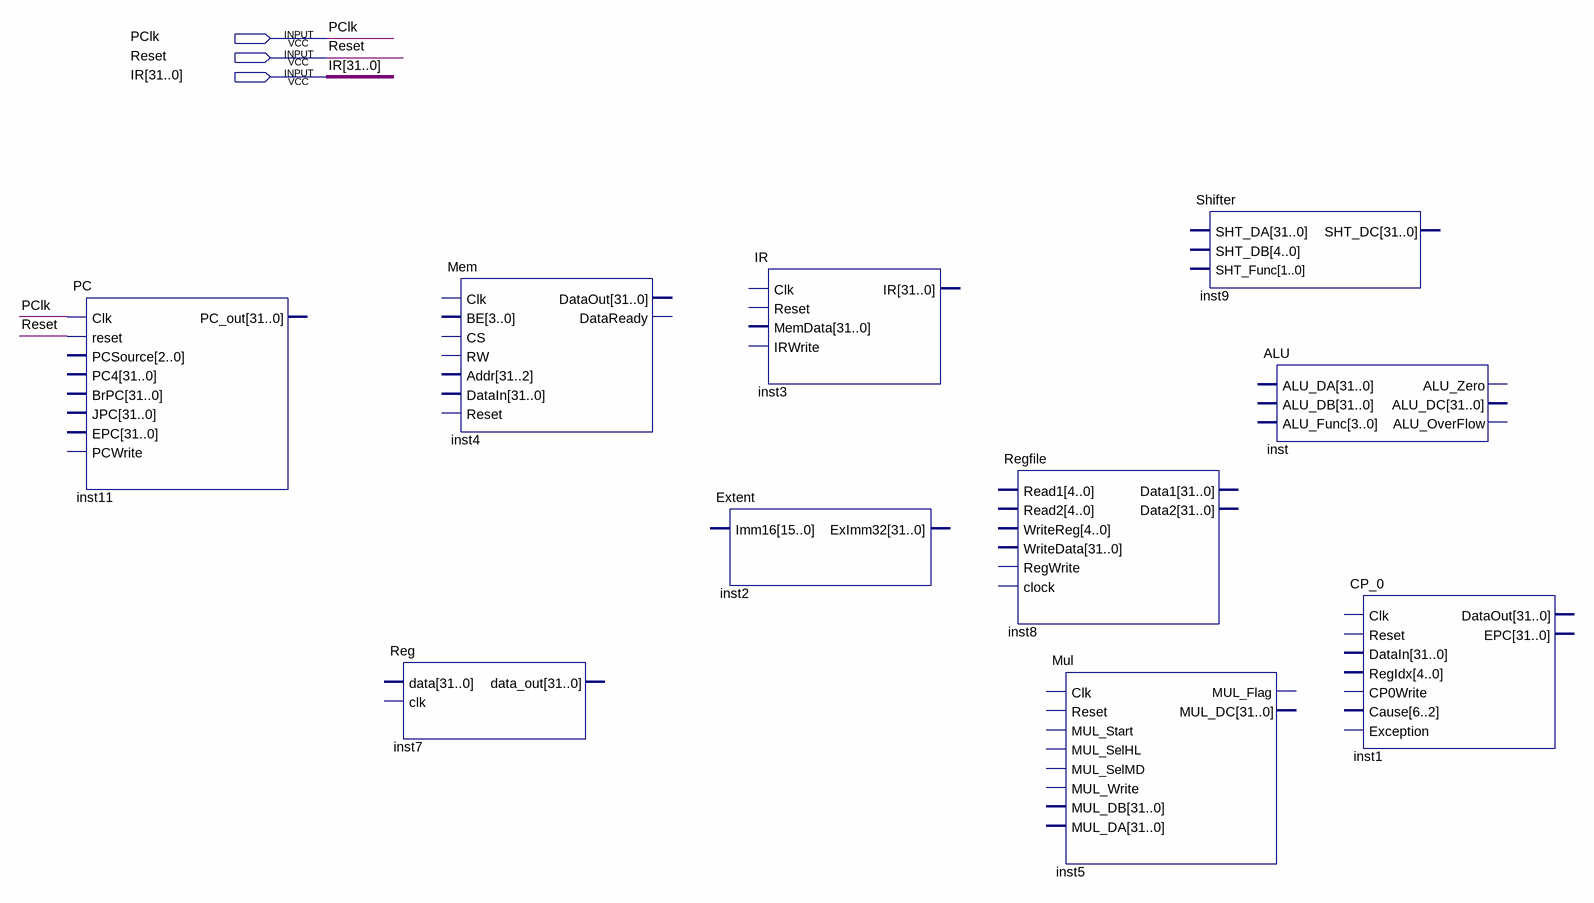
[diagram p0: schematic sheet]
// Quartus schematic MIPSC.bdf as structural Verilog: 10 symbols, 3 pins
module MIPSC (
  input  PClk,
  input  Reset,
  input  [31:0] IR
);

  PC inst11 (.Clk(PClk), .reset(Reset));  // open: PCSource, PC4, BrPC, JPC, EPC, PCWrite, PC_out
  Mem inst4 ();  // open: Clk, BE, CS, RW, Addr, DataIn, Reset, DataOut, DataReady
  Reg inst7 ();  // open: data, clk, data_out
  IR inst3 ();  // open: Clk, Reset, MemData, IRWrite, IR
  Extent inst2 ();  // open: Imm16, ExImm32
  Regfile inst8 ();  // open: Read1, Read2, WriteReg, WriteData, RegWrite, clock, Data1, Data2
  Mul inst5 ();  // open: Clk, Reset, MUL_Start, MUL_SelHL, MUL_SelMD, MUL_Write, MUL_DB, MUL_DA, MUL_Flag, MUL_DC
  Shifter inst9 ();  // open: SHT_DA, SHT_DB, SHT_Func, SHT_DC
  ALU inst ();  // open: ALU_DA, ALU_DB, ALU_Func, ALU_Zero, ALU_DC, ALU_OverFlow
  CP_0 inst1 ();  // open: Clk, Reset, DataIn, RegIdx, CP0Write, Cause, Exception, DataOut, EPC
endmodule
